# Altium schematic sheet RobotCtrl_Power.SchDoc
size A3; Author: Power Lin; DocumentNumber: 1; Revision: 0.3B; SheetNumber: 1; SheetTotal: 1; Website: wiki-power.com
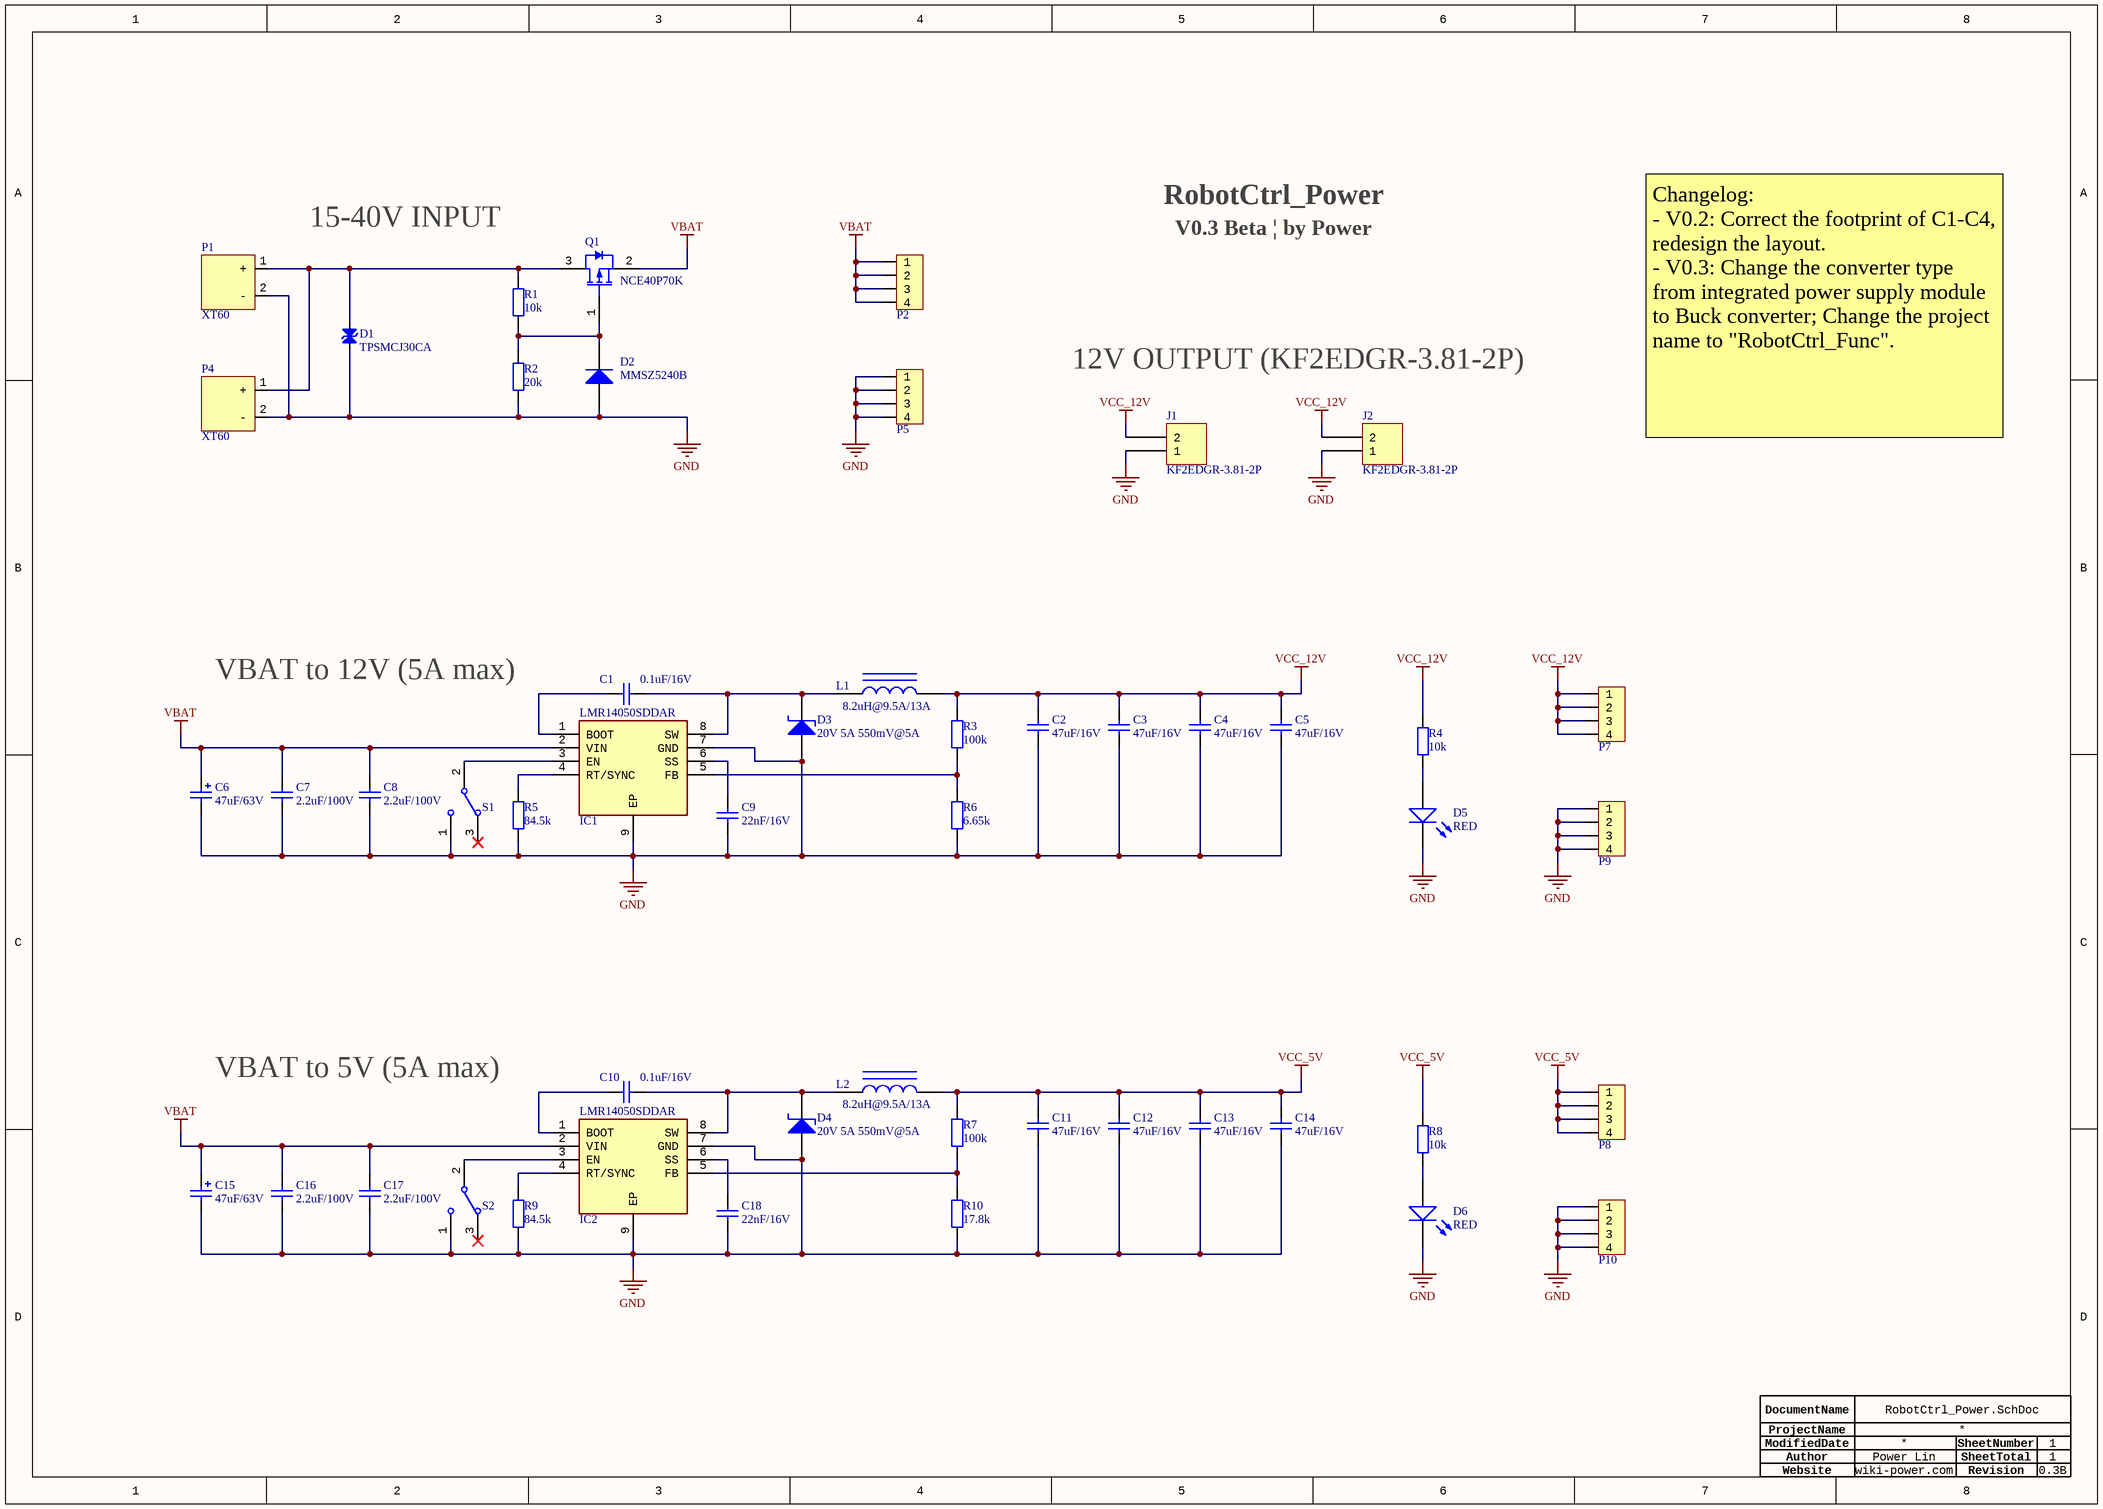
[diagram p0: RobotCtrl_Power.SchDoc]

## Parts
C1  0.1uF/16V  [CAP-0603]
C2  47uF/16V  [CAP-1210]
C3  47uF/16V  [CAP-1210]
C4  47uF/16V  [CAP-1210]
C5  47uF/16V  [CAP-1210]
C6  47uF/63V  [C_SMD-8X10]
C7  2.2uF/100V  [CAP-1206]
C8  2.2uF/100V  [CAP-1206]
C9  22nF/16V  [CAP-0603]
C10  0.1uF/16V  [CAP-0603]
C11  47uF/16V  [CAP-1210]
C12  47uF/16V  [CAP-1210]
C13  47uF/16V  [CAP-1210]
C14  47uF/16V  [CAP-1210]
C15  47uF/63V  [C_SMD-8X10]
C16  2.2uF/100V  [CAP-1206]
C17  2.2uF/100V  [CAP-1206]
C18  22nF/16V  [CAP-0603]
D1  TPSMCJ30CA  [DO-214AB/SMC]
D2  MMSZ5240B  [SOD_123]
D3  20V 5A 550mV@5A  [DO-214AB/SMC]
D4  20V 5A 550mV@5A  [DO-214AB/SMC]
D5  RED  [LED-0603]
D6  RED  [LED-0603]
IC1  LMR14050SDDAR  [HSOIC-8]
IC2  LMR14050SDDAR  [HSOIC-8]
J1  KF2EDGR-3.81-2P  [FCI 06-381-2PIN]
J2  KF2EDGR-3.81-2P  [FCI 06-381-2PIN]
L1  8.2uH@9.5A/13A  [SMD-13.45x12.6x4.8mm]
L2  8.2uH@9.5A/13A  [SMD-13.45x12.6x4.8mm]
P1  XT60  [XT60PW-M]
P2  HDR1x4_2.54  [HDR1x4_2.54_180]  (value not drawn)
P4  XT60  [XT60PW-M]
P5  HDR1x4_2.54  [HDR1x4_2.54_180]  (value not drawn)
P7  HDR1x4_2.54  [HDR1x4_2.54_180]  (value not drawn)
P8  HDR1x4_2.54  [HDR1x4_2.54_180]  (value not drawn)
P9  HDR1x4_2.54  [HDR1x4_2.54_180]  (value not drawn)
P10  HDR1x4_2.54  [HDR1x4_2.54_180]  (value not drawn)
Q1  NCE40P70K  [TO-252]
R1  10k  [R-0603]
R2  20k  [R-0603]
R3  100k  [R-0603]
R4  10k  [R-0603]
R5  84.5k  [R-0603]
R6  6.65k  [R-0603]
R7  100k  [R-0603]
R8  10k  [R-0603]
R9  84.5k  [R-0603]
R10  17.8k  [R-0603]
S1  Switch_SPDT  [SwitchSPDT_2.8X6.6_90]  (value not drawn)
S2  Switch_SPDT  [SwitchSPDT_2.8X6.6_90]  (value not drawn)

## Nets
GND: C2.1 C3.1 C4.1 C5.1 C6.2 C7.1 C8.1 C9.1 C11.1 C12.1 C13.1 C14.1 C15.2 C16.1 C17.1 C18.1 D1.1 D2.1(A) D3.1(A) D4.1(A) D5.K D6.K IC1.7(GND) IC1.9(EP) IC2.7(GND) IC2.9(EP) J1.1 J2.1 P1.2(-) P4.2(-) P5.1 P5.2 P5.3 P5.4 P9.1 P9.2 P9.3 P9.4 P10.1 P10.2 P10.3 P10.4 R2.2 R5.1 R6.1 R9.1 R10.1 S1.1 S2.1
VBAT: C6.1 C7.2 C8.2 C15.1 C16.2 C17.2 IC1.2(VIN) IC2.2(VIN) P2.1 P2.2 P2.3 P2.4 Q1.2(SOURCE)
VCC_5V: C11.2 C12.2 C13.2 C14.2 L2.2 P8.1 P8.2 P8.3 P8.4 R7.2 R8.1
VCC_12V: C2.2 C3.2 C4.2 C5.2 J1.2 J2.2 L1.2 P7.1 P7.2 P7.3 P7.4 R3.2 R4.1
NetC1_1: C1.1 IC1.1(BOOT)
NetC1_2: C1.2 D3.2(K) IC1.8(SW) L1.1
NetC9_2: C9.2 IC1.6(SS)
NetC10_1: C10.1 IC2.1(BOOT)
NetC10_2: C10.2 D4.2(K) IC2.8(SW) L2.1
NetC18_2: C18.2 IC2.6(SS)
NetD1_2: D1.2 P1.1(+) P4.1(+) Q1.3(DRAIN) R1.1
NetD2_2: D2.2(K) Q1.1(GATE) R1.2 R2.1
NetD5_A: D5.A R4.2
NetD6_A: D6.A R8.2
NetIC1_3: IC1.3(EN) S1.2
NetIC1_4: IC1.4(RT/SYNC) R5.2
NetIC1_5: IC1.5(FB) R3.1 R6.2
NetIC2_3: IC2.3(EN) S2.2
NetIC2_4: IC2.4(RT/SYNC) R9.2
NetIC2_5: IC2.5(FB) R7.1 R10.2

Not connected (* = marked no-connect by the designer): S1 3*; S2 3*

## Notes on the sheet
- 15-40V INPUT
- RobotCtrl_Power
- V0.3 Beta | by Power
- 12V OUTPUT (KF2EDGR-3.81-2P)
- Changelog:
  - V0.2: Correct the footprint of C1-C4, redesign the layout.
  - V0.3: Change the converter type from integrated power supply module to Buck converter; Change the project name to "RobotCtrl_Func".
- VBAT to 12V (5A max)
- VBAT to 5V (5A max)
- Author
- DocumentName
- ModifiedDate
- ProjectName
- SheetNumber
- SheetTotal
- Website
- Revision

## Library data of the parts
C1 C10 = CAP: CC0603KRX7R7BB104; ComponentLink1Description: 供应商链接; ComponentLink1URL: http://www.szlcsc.com/product/details_53938.html; Package: 0402; Supplier: LC; SuppliersPartNumber: C52923
C2-C5 C11-C14 = CAP: C1210X5R476K160NT; ComponentLink1Description: 供应商链接; ComponentLink1URL: http://www.szlcsc.com/product/details_53938.html; Package: 0402; Supplier: LC; SuppliersPartNumber: C52923
C6 C15 = CAP-POL: RVT1J470M0810; ComponentLink1Description: 供应商链接; ComponentLink1URL: http://www.szlcsc.com/product/details_16815.html; Package: 3528; Supplier: LC; SuppliersPartNumber: C16133
C7 C8 C16 C17 = CAP: CS3216X7R225K101NRI; ComponentLink1Description: 供应商链接; ComponentLink1URL: http://www.szlcsc.com/product/details_53938.html; Package: 0402; Supplier: LC; SuppliersPartNumber: C52923
C9 C18 = CAP: CC0603KRX7R7BB223; ComponentLink1Description: 供应商链接; ComponentLink1URL: http://www.szlcsc.com/product/details_53938.html; Package: 0402; Supplier: LC; SuppliersPartNumber: C52923
D1 = TVS_C
D2 = DIODE: 稳压 10V; ComponentLink1Description: 供应商链接; ComponentLink1URL: http://www.szlcsc.com/product/details_23178.html; Package: SMA(DO-214AC); Supplier: LC; SuppliersPartNumber: C22452
D3 D4 = DIODE_Schottky: SS52
D5 D6 = LED: 发光二极管; pin to pad: A>1 K>2; ComponentLink1Description: 供应商链接; ComponentLink1URL: http://www.szlcsc.com/product/details_2663.html; Package: 0603; Supplier: LC; SuppliersPartNumber: C2290
IC1 IC2 = LMR14050SDDAR: Manufacturer_Name: Texas Instruments; Datasheet Link: http://www.ti.com/lit/gpn/lmr14050; Height: 1.7mm; Manufacturer_Part_Number: LMR14050SDDAR; Mouser Part Number: 595-LMR14050SDDAR; Mouser Price/Stock: https://www.mouser.co.uk/ProductDetail/Texas-Instruments/LMR14050SDDAR?qs=G5PZsBocSXuzvyUQdQ5q2Q%3D%3D; Arrow Part Number: LMR14050SDDAR; Arrow Price/Stock: https://www.arrow.com/en/products/lmr14050sddar/texas-instruments?region=nac
J1 J2 = KF2EDGR-3.81-2P: TERM BLOCK HDR 2POS 90DEG 3.81MM; Part Number: OQ0232510000G; Manufacturer: Amphenol Anytek; Manufacturer: Amphenol; Number of Levels: 1; Number of Positions: 2; Header Orientation: 90°, Right Angle; Current - UL: 10A; Pitch: 0.150" (3.81mm); Voltage - UL: 300V; Lifecycle Status: 0; ComponentLink1Description: Datasheet; Series: 06-381; Color: Green; Termination Style: Solder; Minimum Order: 1; Type: Header, Male Pins, Shrouded (4 Side); LastUpdated: 2019-12-16 19:14:30.110; Operating Temperature: -40°C ~ 115°C; Packaging: Bulk; ComponentLink1URL: http://portal.fciconnect.com/Comergent//fci/drawing/oqxx32x100j0g.pdf; Price: 0.49; Mounting Type: Through Hole; Positions Per Level: 2; Contact Mating Finish: Tin; Part Status: Active; Manufacturer Part Number: OQ0232510000G; Component Type: 接线端子
L1 L2 = INDUCTOR: MDE1250-8R2M; ComponentLink1Description: 供应商链接; ComponentLink1URL: http://www.szlcsc.com/product/details_33003.html; Package: 0402; Supplier: LC; SuppliersPartNumber: C32041
P1 P4 = XT30/60
P2 P5 = HDR1x4_2.54: Header
P7-P10 = HDR1x4_2.54: Header; System: Connector
Q1 = P-MOS: Manufacturer: NCE Power; Mounting Technology: SM; Package Reference: SOT23-3; Case/Package: SOT23-3; Package Description: 3-Pin Small Outline Transistor, Body 2.9 x 1.3 mm, Pitch 0.95 mm; Datasheet Version: Rev. 1.1, 07/2014; RoHS Compliant: Unknown; Datasheet URL: http://www.ncepower.com/Upload/MOSFET/mos1/55vpmos/NCE3407Adatasheet-17275285683.pdf; Component Type: Transistors
R1 R2 R4 R8 = RES: 贴片电阻; Package: 0805; Supplier: LC; SuppliersPartNumber: C17798
R3 R7 = RES: RC0603FR-07100KL; Package: 0805; Supplier: LC; SuppliersPartNumber: C17798
R5 R9 = RES: RC0603FR-0784K5L; Package: 0805; Supplier: LC; SuppliersPartNumber: C17798
R6 = RES: RC0603FR-076K65L; Package: 0805; Supplier: LC; SuppliersPartNumber: C17798
R10 = RES: RC0603FR-0717K8L; Package: 0805; Supplier: LC; SuppliersPartNumber: C17798
S1 S2 = Switch_SPDT: TA-3524A-A1; Value: SPDT 3P; Type: SPDT